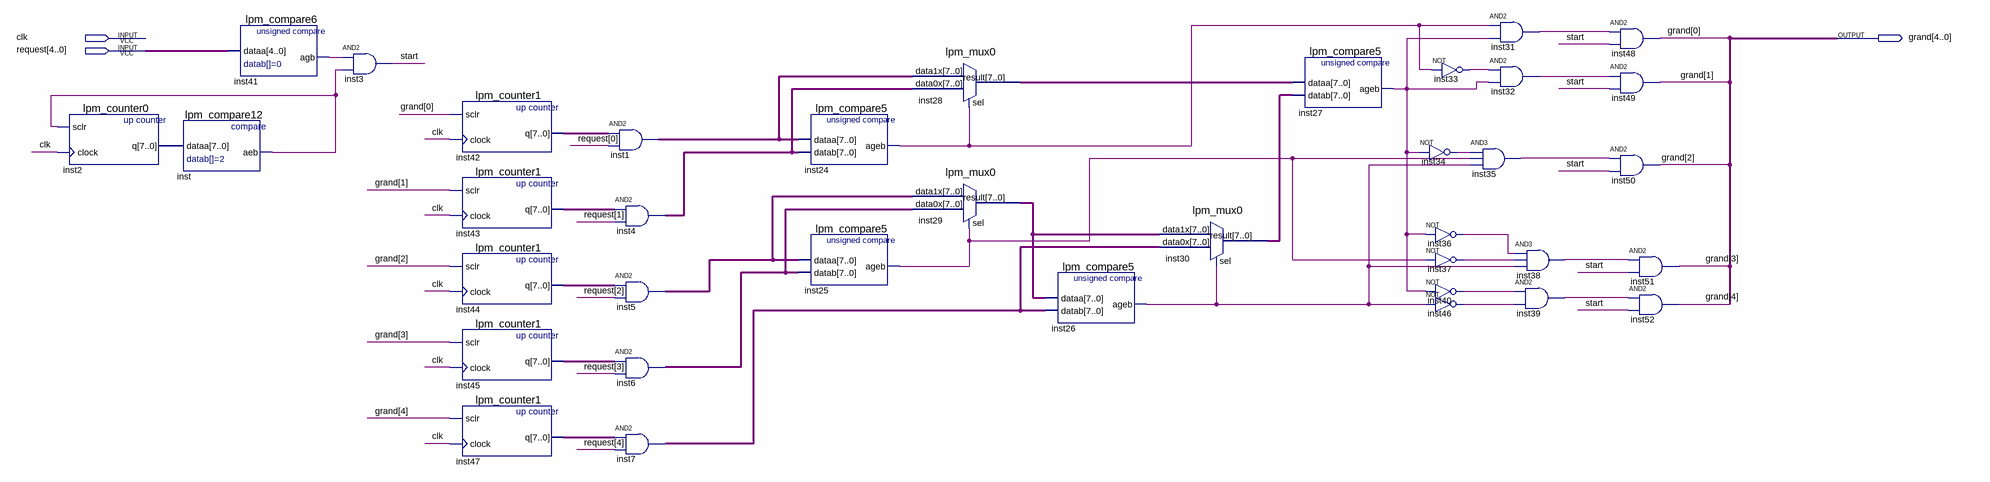
[diagram p0: schematic sheet]
// Quartus schematic arbitr.bdf as structural Verilog: 37 symbols, 3 pins
module arbitr (
  input  clk,
  input  [4:0] request,
  output [4:0] grand
);

  wire inst24_ageb, inst25_ageb, inst26_ageb, inst27_ageb, inst31_out, inst32_out, inst33_out, inst34_out,
       inst35_out, inst36_out, inst37_out, inst38_out, inst39_out, inst40_out, inst41_agb, inst46_out,
       inst_aeb, start;
  wire [7:0] inst1_out, inst2_q, inst4_out, inst5_out, inst6_out, inst7_out, inst28_result, inst29_result,
       inst30_result, inst42_q, inst43_q, inst44_q, inst45_q, inst47_q;

  lpm_counter0 inst2 (.sclr(inst_aeb), .clock(clk), .q(inst2_q));
  lpm_compare12 inst (.dataa(inst2_q), .aeb(inst_aeb));
  lpm_compare6 inst41 (.dataa(request), .agb(inst41_agb));
  and inst3 (start, inst41_agb, inst_aeb);
  lpm_counter1 inst42 (.sclr(grand[0]), .clock(clk), .q(inst42_q));
  lpm_counter1 inst43 (.sclr(grand[1]), .clock(clk), .q(inst43_q));
  lpm_counter1 inst44 (.sclr(grand[2]), .clock(clk), .q(inst44_q));
  lpm_counter1 inst45 (.sclr(grand[3]), .clock(clk), .q(inst45_q));
  lpm_counter1 inst47 (.sclr(grand[4]), .clock(clk), .q(inst47_q));
  assign inst1_out = inst42_q & {8{request[0]}};  // AND2 inst1, 8 bits wide
  assign inst4_out = inst43_q & {8{request[1]}};  // AND2 inst4, 8 bits wide
  assign inst5_out = inst44_q & {8{request[2]}};  // AND2 inst5, 8 bits wide
  assign inst6_out = inst45_q & {8{request[3]}};  // AND2 inst6, 8 bits wide
  assign inst7_out = inst47_q & {8{request[4]}};  // AND2 inst7, 8 bits wide
  lpm_compare5 inst24 (.dataa(inst1_out), .datab(inst4_out), .ageb(inst24_ageb));
  lpm_compare5 inst25 (.dataa(inst5_out), .datab(inst6_out), .ageb(inst25_ageb));
  lpm_mux0 inst28 (.data1x(inst1_out), .data0x(inst4_out), .sel(inst24_ageb), .result(inst28_result));
  lpm_mux0 inst29 (.data1x(inst5_out), .data0x(inst6_out), .sel(inst25_ageb), .result(inst29_result));
  lpm_compare5 inst26 (.dataa(inst29_result), .datab(inst7_out), .ageb(inst26_ageb));
  lpm_mux0 inst30 (.data1x(inst29_result), .data0x(inst7_out), .sel(inst26_ageb), .result(inst30_result));
  lpm_compare5 inst27 (.dataa(inst28_result), .datab(inst30_result), .ageb(inst27_ageb));
  not inst33 (inst33_out, inst24_ageb);
  not inst34 (inst34_out, inst27_ageb);
  not inst36 (inst36_out, inst27_ageb);
  not inst37 (inst37_out, inst25_ageb);
  not inst40 (inst40_out, inst27_ageb);
  not inst46 (inst46_out, inst26_ageb);
  and inst31 (inst31_out, inst24_ageb, inst27_ageb);
  and inst32 (inst32_out, inst33_out, inst27_ageb);
  and inst35 (inst35_out, inst34_out, inst25_ageb, inst26_ageb);
  and inst38 (inst38_out, inst36_out, inst37_out, inst26_ageb);
  and inst39 (inst39_out, inst40_out, inst46_out);
  and inst48 (grand[0], inst31_out, start);
  and inst49 (grand[1], inst32_out, start);
  and inst50 (grand[2], inst35_out, start);
  and inst51 (grand[3], inst38_out, start);
  and inst52 (grand[4], inst39_out, start);
endmodule
